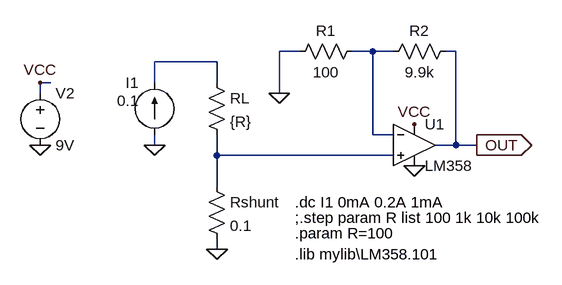
[diagram p0: schematic I-V Convert.asc]
I-V Convert.asc, the LTspice schematic file:
Version 4
SHEET 1 880 680
WIRE 32 16 0 16
WIRE 144 16 112 16
WIRE 176 16 144 16
WIRE 272 16 256 16
WIRE -96 32 -192 32
WIRE -352 64 -368 64
WIRE -192 64 -192 32
WIRE -96 64 -96 32
WIRE -368 80 -368 64
WIRE 0 80 0 16
WIRE 144 144 144 16
WIRE 176 144 144 144
WIRE -192 160 -192 144
WIRE 272 160 272 16
WIRE 272 160 240 160
WIRE 304 160 272 160
WIRE -96 176 -96 144
WIRE 176 176 -96 176
WIRE -96 224 -96 176
WIRE -96 320 -96 304
FLAG -368 160 0
FLAG -192 160 0
FLAG 208 192 0
FLAG -368 64 VCC
FLAG 208 128 VCC
FLAG 0 80 0
FLAG -96 320 0
FLAG 304 160 OUT
IOPIN 304 160 Out
SYMBOL res 128 0 R90
WINDOW 0 0 56 VBottom 2
WINDOW 3 32 56 VTop 2
SYMATTR InstName R1
SYMATTR Value 100
SYMBOL voltage -368 64 R0
WINDOW 123 0 0 Left 2
WINDOW 39 0 0 Left 2
SYMATTR InstName V2
SYMATTR Value 9V
SYMBOL res 272 0 R90
WINDOW 0 0 56 VBottom 2
WINDOW 3 32 56 VTop 2
SYMATTR InstName R2
SYMATTR Value 9.9k
SYMBOL current -192 144 R180
WINDOW 0 24 80 Left 2
WINDOW 3 24 52 Left 2
WINDOW 123 0 0 Left 2
WINDOW 39 0 0 Left 2
SYMATTR InstName I1
SYMATTR Value 0.1
SYMBOL res -112 208 R0
SYMATTR InstName Rshunt
SYMATTR Value 0.1
SYMBOL res -112 48 R0
SYMATTR InstName RL
SYMATTR Value {R}
SYMBOL Opamps\\opamp2 208 96 R0
SYMATTR InstName U1
SYMATTR Value LM358
TEXT 24 248 Left 2 !.dc I1 0mA 0.2A 1mA
TEXT 24 272 Left 2 !;.step param R list 100 1k 10k 100k
TEXT 24 328 Left 2 !.lib mylib\\LM358.101
TEXT 24 296 Left 2 !.param R=100

The netlist it stands for:
* I-V Convert.asc
R1 N001 0 100
V2 VCC 0 9V
R2 OUT N001 9.9k
I1 0 N002 0.1
Rshunt N003 0 0.1
RL N002 N003 {R}
XU1 N003 N001 VCC 0 OUT LM358  ; pins In+ In- V+ V- OUT
.dc I1 0mA 0.2A 1mA
;.step param R list 100 1k 10k 100k
.lib mylib\LM358.101
.param R=100
.backanno
.end